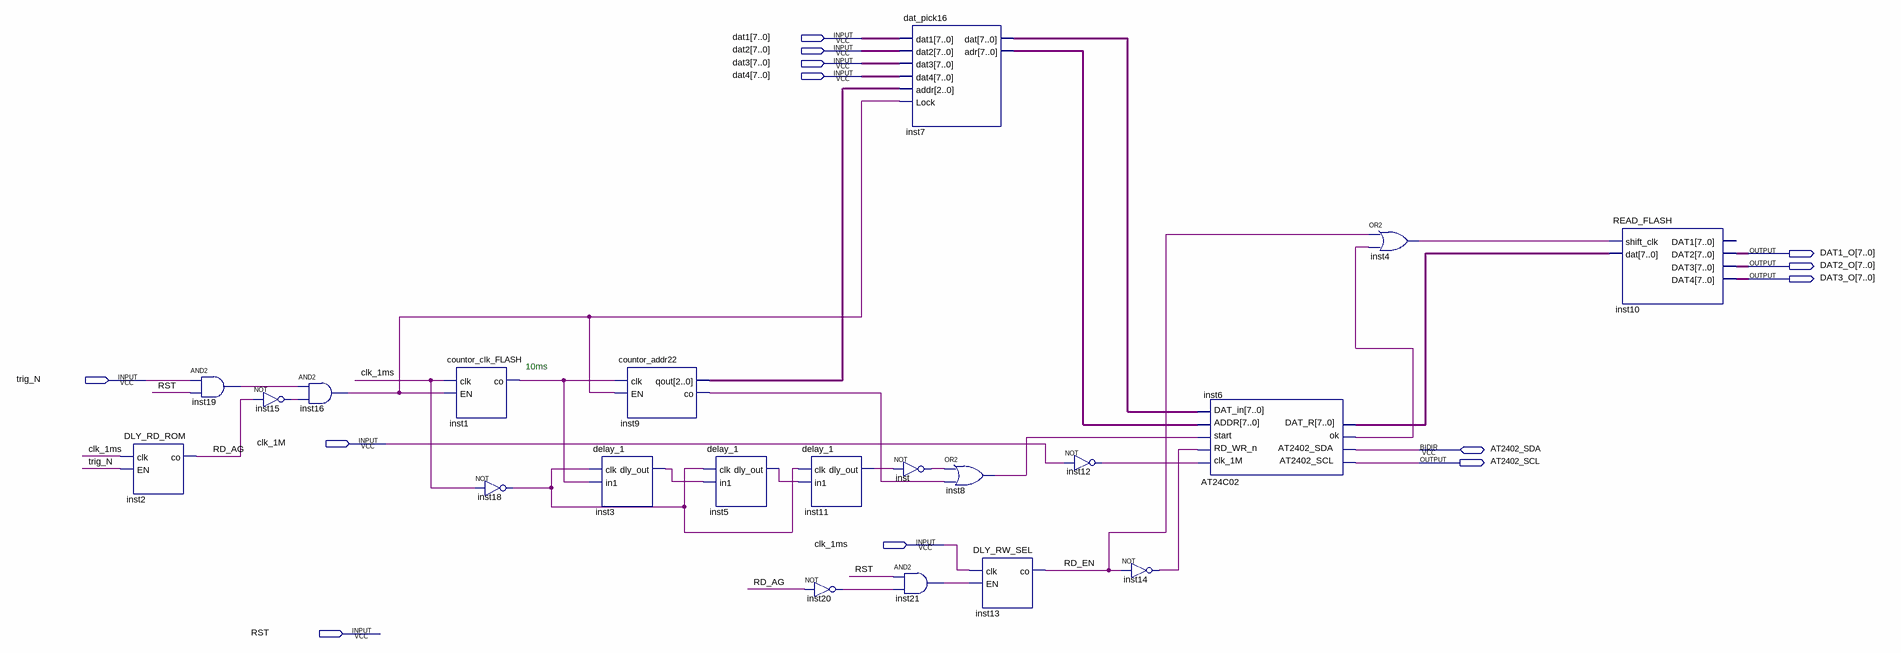
[diagram p0: schematic sheet]
// Quartus schematic AT_DAT_STORE.bdf as structural Verilog: 21 symbols, 13 pins
module AT_DAT_STORE (
  input  [7:0] dat1,
  input  [7:0] dat2,
  input  [7:0] dat3,
  input  [7:0] dat4,
  input  trig_N,
  input  clk_1M,
  input  clk_1ms,
  input  RST,
  inout  AT2402_SDA,
  output [7:0] DAT1_O,
  output [7:0] DAT2_O,
  output [7:0] DAT3_O,
  output AT2402_SCL
);

  wire inst1_co, inst3_dly_out, inst4_out, inst5_dly_out, inst6_ok, inst8_out, inst9_co, inst11_dly_out,
       inst12_out, inst14_out, inst15_out, inst16_out, inst18_out, inst19_out, inst20_out, inst21_out,
       inst_out, RD_AG, RD_EN;
  wire [2:0] inst9_qout;
  wire [7:0] inst6_dat_r, inst7_adr, inst7_dat;

  DLY_RD_ROM inst2 (.clk(clk_1ms), .EN(trig_N), .co(RD_AG));
  and inst19 (inst19_out, trig_N, RST);
  and inst16 (inst16_out, inst19_out, inst15_out);
  not inst15 (inst15_out, RD_AG);
  countor_clk_FLASH inst1 (.clk(clk_1ms), .EN(inst16_out), .co(inst1_co));
  not inst18 (inst18_out, clk_1ms);
  delay_1 inst3 (.clk(inst18_out), .in1(inst1_co), .dly_out(inst3_dly_out));
  countor_addr22 inst9 (.clk(inst1_co), .EN(inst16_out), .qout(inst9_qout), .co(inst9_co));
  delay_1 inst5 (.clk(inst18_out), .in1(inst3_dly_out), .dly_out(inst5_dly_out));
  delay_1 inst11 (.clk(inst18_out), .in1(inst5_dly_out), .dly_out(inst11_dly_out));
  not inst20 (inst20_out, RD_AG);
  dat_pick16 inst7 (
    .dat1(dat1), .dat2(dat2), .dat3(dat3), .dat4(dat4), .addr(inst9_qout), .Lock(inst16_out),
    .dat(inst7_dat), .adr(inst7_adr));
  not inst (inst_out, inst11_dly_out);
  and inst21 (inst21_out, RST, inst20_out);
  or inst8 (inst8_out, inst_out, inst9_co);
  DLY_RW_SEL inst13 (.clk(clk_1ms), .EN(inst21_out), .co(RD_EN));
  not inst12 (inst12_out, clk_1M);
  not inst14 (inst14_out, RD_EN);
  AT24C02 inst6 (
    .clk_1M(inst12_out), .RD_WR_n(inst14_out), .start(inst8_out), .ADDR(inst7_adr), .DAT_in(inst7_dat),
    .AT2402_SCL(AT2402_SCL), .ok(inst6_ok), .DAT_R(inst6_dat_r), .AT2402_SDA(AT2402_SDA));
  or inst4 (inst4_out, RD_EN, inst6_ok);
  READ_FLASH inst10 (
    .shift_clk(inst4_out), .dat(inst6_dat_r), .DAT2(DAT1_O), .DAT3(DAT2_O), .DAT4(DAT3_O));  // open: DAT1

  // Notes on the sheet:
  //   10ms
endmodule
